# EAGLE design electrical stuff 2.0 (EAGLE 9.1.1)
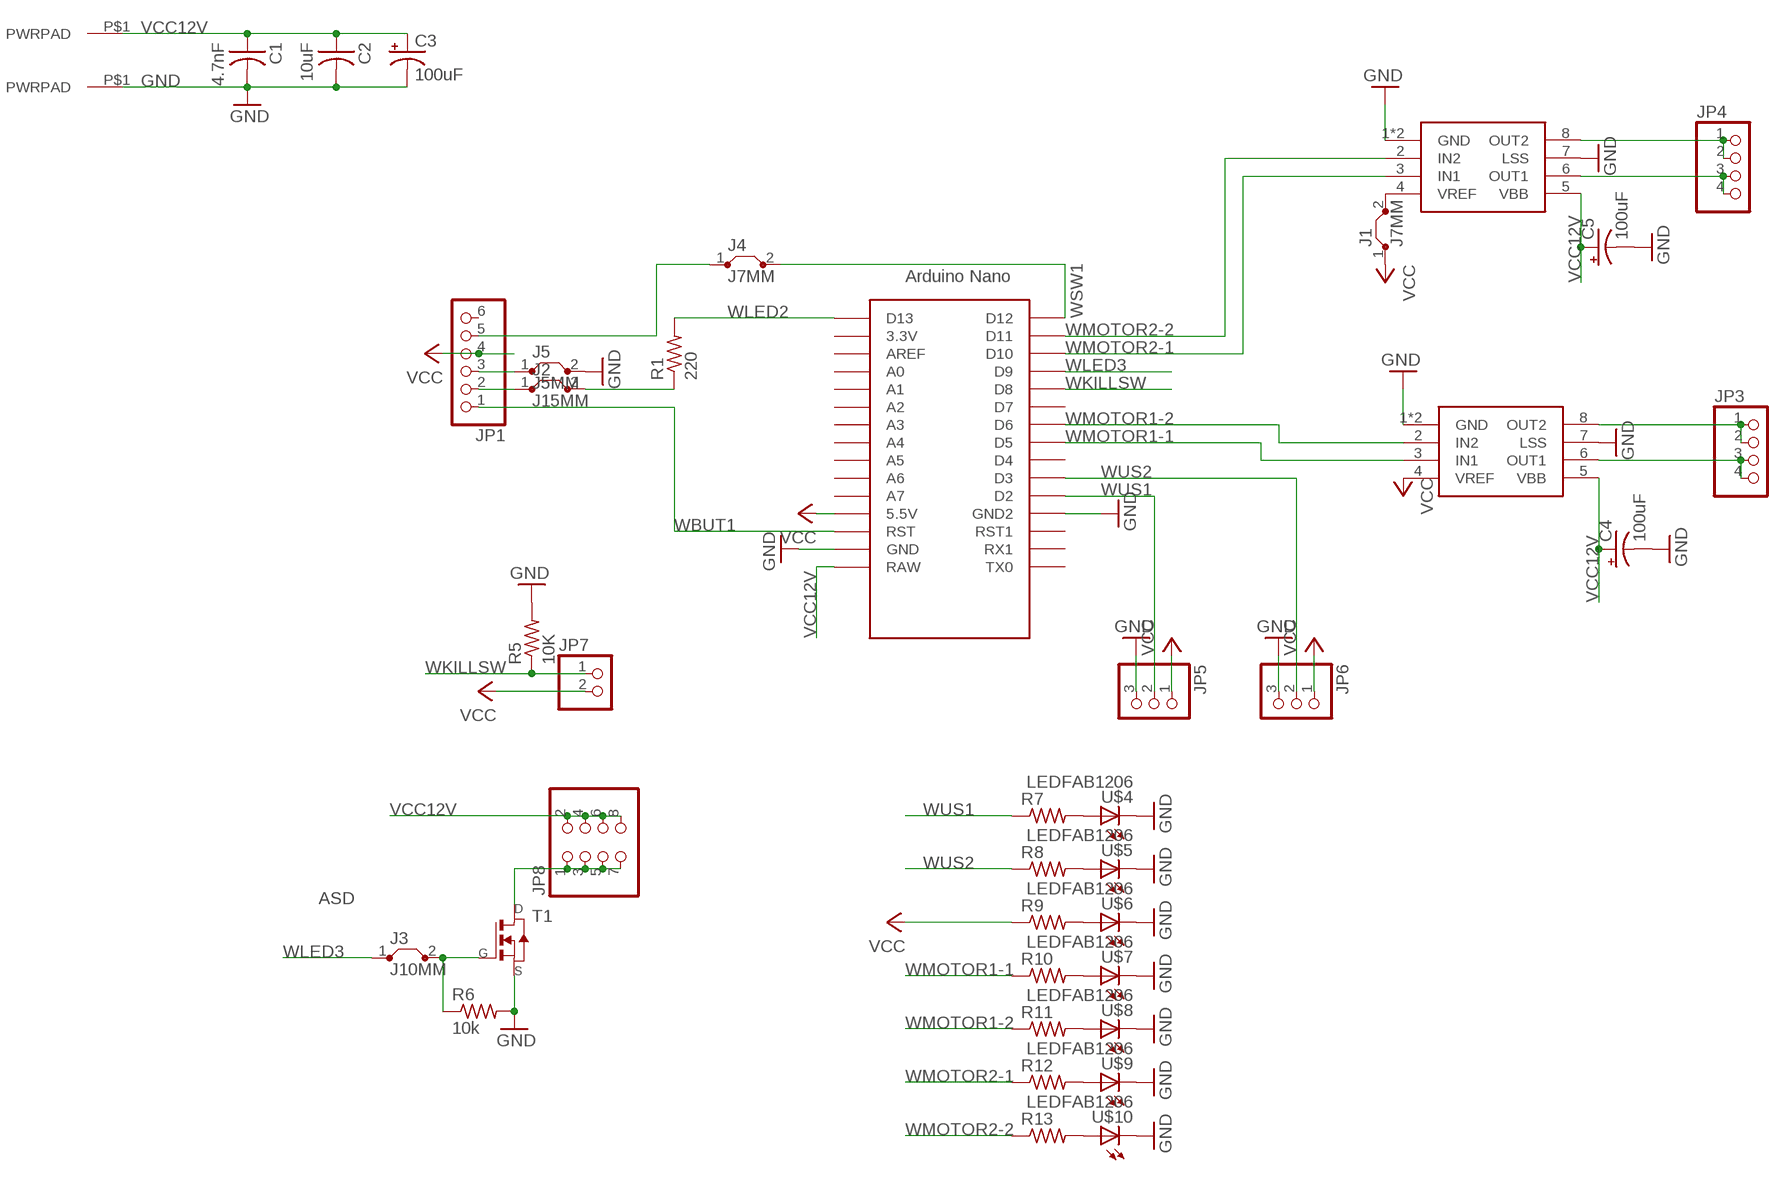
[diagram p0: schematic, sheet 1]

## Parts
C1  4.7nF  CAP-US1206FAB  [C1206FAB]
C2  10uF  CAP-US1206FAB  [C1206FAB]
C3  100uF  100UF-POLAR-RADIAL-2.5MM-25V-20%  [CPOL-RADIAL-2.5MM-6.5MM]
C4  100uF  100UF-POLAR-RADIAL-2.5MM-25V-20%  [CPOL-RADIAL-2.5MM-6.5MM]
C5  100uF  100UF-POLAR-RADIAL-2.5MM-25V-20%  [CPOL-RADIAL-2.5MM-6.5MM]
GND  PWRPAD2-5MM  [PWRPAD_2-5MM]
J1  J7MM  [07]
J2  J15MM  [15]
J3  J10MM  [10]
J4  J7MM  [07]
J5  J5MM  [05]
JP1  PINHD-1X6  [1X06]
JP3  PINHD-1X4  [1X04]
JP4  PINHD-1X4  [1X04]
JP5  PINHD-1X3  [1X03]
JP6  PINHD-1X3  [1X03]
JP7  PINHD-1X2  [1X02]
JP8  PINHD-2X4  [2X04]
R1  220  RES-US1206FAB  [R1206FAB]
R5  10K  RES-US1206FAB  [R1206FAB]
R6  10k  RES-US1206FAB  [R1206FAB]
R7  RES-US1206FAB  [R1206FAB]
R8  RES-US1206FAB  [R1206FAB]
R9  RES-US1206FAB  [R1206FAB]
R10  RES-US1206FAB  [R1206FAB]
R11  RES-US1206FAB  [R1206FAB]
R12  RES-US1206FAB  [R1206FAB]
R13  RES-US1206FAB  [R1206FAB]
T1  NMOSFETTO252  [TO252]
U$1  NANO  [NANO]
U$2  A4953  A4953-H-BRIDGE-MOTOR-DRIVER-PAD  [SOIC8_PAD]
U$3  A4953  A4953-H-BRIDGE-MOTOR-DRIVER-PAD  [SOIC8_PAD]
U$4  LEDFAB1206  [LED1206FAB]
U$5  LEDFAB1206  [LED1206FAB]
U$6  LEDFAB1206  [LED1206FAB]
U$7  LEDFAB1206  [LED1206FAB]
U$8  LEDFAB1206  [LED1206FAB]
U$9  LEDFAB1206  [LED1206FAB]
U$10  LEDFAB1206  [LED1206FAB]
VCC12V  VCC12V  PWRPAD2-5MM  [PWRPAD_2-5MM]

## Nets
ASD: J3.2 R6.1 T1.1(G)
GND: C1.2 C2.2 C3.2(-) C4.2(-) C5.2(-) GND.P$1(PWRPAD) J5.2 JP5.3 JP6.3 R5.2 R6.2 T1.2(S) U$1.GND U$1.GND1(GND2) U$2.1(GND) U$2.7(LSS) U$2.GND U$3.1(GND) U$3.7(LSS) U$3.GND U$4.2(C) U$5.2(C) U$6.2(C) U$7.2(C) U$8.2(C) U$9.2(C) U$10.2(C)
N$1: J5.1 JP1.3
N$2: JP8.1 JP8.3 JP8.5 JP8.7 T1.3(D)
N$3: JP4.3 JP4.4 U$3.6(OUT1)
N$5: J2.2 R1.1
N$8: JP4.1 JP4.2 U$3.8(OUT2)
N$9: JP3.1 JP3.2 U$2.8(OUT2)
N$10: JP3.3 JP3.4 U$2.6(OUT1)
N$11: J1.2 U$3.4(VREF)
N$14: J2.1 JP1.2
N$15: R7.2 U$4.1(A)
N$16: J4.1 JP1.5
N$17: R8.2 U$5.1(A)
N$18: R9.2 U$6.1(A)
N$19: R10.2 U$7.1(A)
N$20: R11.2 U$8.1(A)
N$21: R12.2 U$9.1(A)
N$22: R13.2 U$10.1(A)
VCC: J1.1 JP1.4 JP5.1 JP6.1 JP7.2 R9.1 U$1.5V(5.5V) U$2.4(VREF)
VCC12V: C1.1 C2.1 C3.1(+) C4.1(+) C5.1(+) JP8.2 JP8.4 JP8.6 JP8.8 U$1.RAW U$2.5(VBB) U$3.5(VBB) VCC12V.P$1(PWRPAD)
WBUT1: JP1.1 U$1.RST
WKILLSW: JP7.1 R5.1 U$1.D8
WLED2: R1.2 U$1.D13
WLED3: J3.1 U$1.D9
WMOTOR1-1: R10.1 U$1.D5 U$2.3(IN1)
WMOTOR1-2: R11.1 U$1.D6 U$2.2(IN2)
WMOTOR2-1: R12.1 U$1.D10 U$3.3(IN1)
WMOTOR2-2: R13.1 U$1.D11 U$3.2(IN2)
WSW1: J4.2 U$1.D12
WUS1: JP5.2 R7.1 U$1.D2
WUS2: JP6.2 R8.1 U$1.D3
Unconnected: JP1.6 U$1.3.3V U$1.A0 U$1.A1 U$1.A2 U$1.A3 U$1.A4 U$1.A5 U$1.A6 U$1.A7 U$1.AREF U$1.D4 U$1.D7 U$1.ICSP1 U$1.ICSP2 U$1.ICSP3 U$1.ICSP4 U$1.ICSP5 U$1.ICSP6 U$1.RST1 U$1.RX1 U$1.TX0

## Library data of the parts
C1 C2 = fab:CAP-US
C3-C5 = SparkFun-Capacitors:100UF-POLAR: 100µF polarized capacitors A capacitor is a passive two-terminal electrical component used to store electrical energy temporarily in an electric field.; PROD_ID: CAP-08439
GND VCC12V = fab:PWRPAD
J1-J5 = jumper:J: Bridge
JP1 = pinhead:PINHD-1X6: PIN HEADER
JP3 JP4 = pinhead:PINHD-1X4: PIN HEADER
JP5 JP6 = pinhead:PINHD-1X3: PIN HEADER
JP7 = pinhead:PINHD-1X2: PIN HEADER
JP8 = pinhead:PINHD-2X4: PIN HEADER
R1 R5-R13 = fab:RES-US: Resistor (US Symbol) Variants with postfix FAB are widened to allow the routing of internal traces
T1 = fab:NMOSFET: MOS FET
U$1 = Arduino-clone:NANO: Arduino Nano
U$2 U$3 = fab:A4953-H-BRIDGE-MOTOR-DRIVER-PAD
U$4-U$10 = fab:LED: LED

## Board
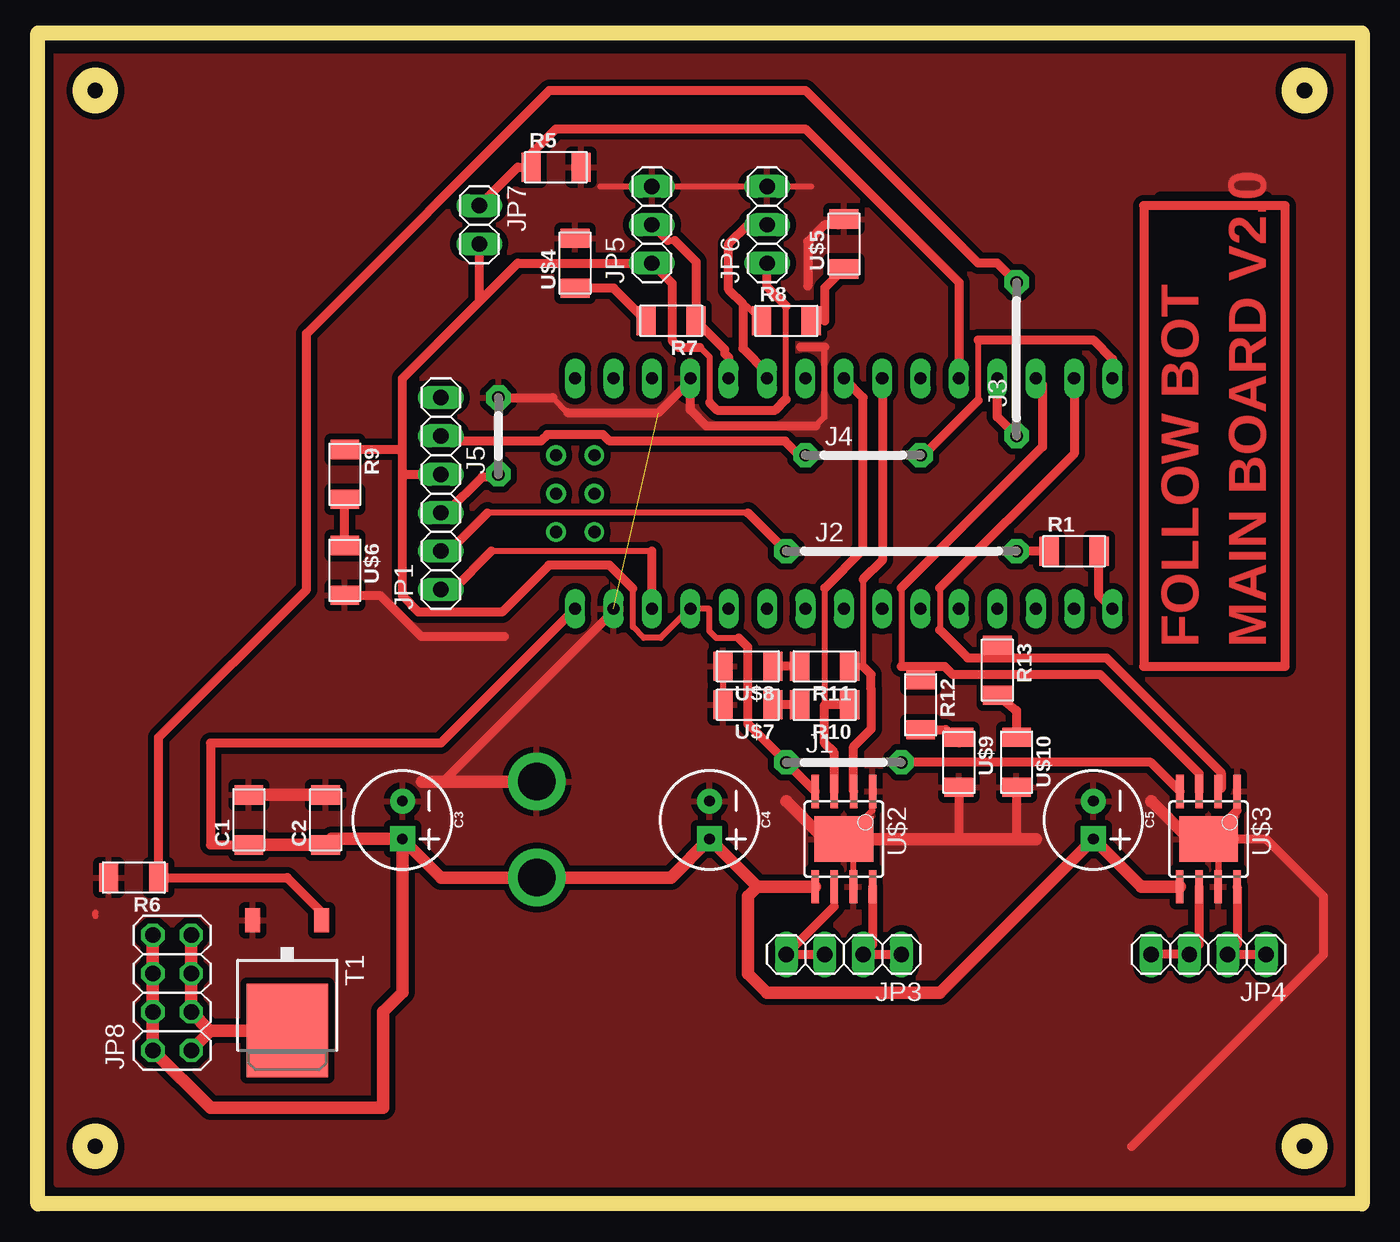
[diagram p1: board, top side]

Size 87.61 x 77.14 mm. Coordinates in mm from the lower left corner, seen from the top.
Outline: 0,0 87.61,0 87.61,77.14 0,77.14 0,0
Copper layers (1*16): Top 0.035mm / dielectric 1.5mm / Bottom 0.035mm
Design rules "default *": minimum track width 16mil, minimum drill 0.35mm, track to track 16mil, track to pad 16mil, pad to pad 16mil, via to via 16mil, smd to smd 6mil, copper to edge 40mil, drill to drill 6mil, minimum pad ring 10mil, minimum via ring 8mil, stop-mask expansion 4mil, vias tented up to drill 0mil, thermal gap 16mil
Milling: area 2.8,72.7 to 4.8,74.7; area 82.8,72.7 to 84.8,74.7; area 82.8,2.8 to 84.8,4.8; area 2.8,2.8 to 4.8,4.8; 4 lines

### Footprints (pad centres in the part's own frame; a part is rotated, then mirrored left to right if it is on the bottom)
C1206FAB = smd 1.27 x 1.905: 1 -1.651,0; 2 1.651,0
CPOL-RADIAL-2.5MM-6.5MM = drill 0.7 pad 1.651 square: 1 1.25,0 | drill 0.7 pad 1.651: 2 -1.25,0
PWRPAD_2-5MM = drill 2.489 pad 3.81: P$1 0,0
07 = drill 0.813 pad 1.6 octagon: 1 -3.81,0; 2 3.81,0
15 = drill 0.813 pad 1.6 octagon: 1 -7.62,0; 2 7.62,0
10 = drill 0.813 pad 1.6 octagon: 1 -5.08,0; 2 5.08,0
05 = drill 0.813 pad 1.6 octagon: 1 -2.54,0; 2 2.54,0
1X06 = drill 1.016 long: 1 -6.35,0; 2 -3.81,0; 3 -1.27,0; 4 1.27,0; 5 3.81,0; 6 6.35,0
1X04 = drill 1.016 long: 1 -3.81,0; 2 -1.27,0; 3 1.27,0; 4 3.81,0
1X03 = drill 1.016 long: 1 -2.54,0; 2 0,0; 3 2.54,0
1X02 = drill 1.016 long: 1 -1.27,0; 2 1.27,0
2X04 = drill 1.016 octagon: 1 -3.81,-1.27; 2 -3.81,1.27; 3 -1.27,-1.27; 4 -1.27,1.27; 5 1.27,-1.27; 6 1.27,1.27; 7 3.81,-1.27; 8 3.81,1.27
R1206FAB = smd 1.27 x 1.905: 1 -1.651,0; 2 1.651,0
TO252 = smd 1 x 1.6: 1 -2.28,-4.8; 2 2.28,-4.8 | smd 5.4 x 6.2: 3 0,2.5
NANO = drill 0.8 long: 3.3V -10.16,24.13; 5V -10.16,-1.27; A0 -10.16,19.05; A1 -10.16,16.51; A2 -10.16,13.97; A3 -10.16,11.43; A4 -10.16,8.89; A5 -10.16,6.35; A6 -10.16,3.81; A7 -10.16,1.27; AREF -10.16,21.59; D2 5.08,1.27; D3 5.08,3.81; D4 5.08,6.35; D5 5.08,8.89; D6 5.08,11.43; D7 5.08,13.97; D8 5.08,16.51; D9 5.08,19.05; D10 5.08,21.59; D11 5.08,24.13; D12 5.08,26.67; D13 -10.16,26.67; GND -10.16,-6.35; GND1 5.08,-1.27; RAW -10.16,-8.89; RST -10.16,-3.81; RST1 5.08,-3.81; RX1 5.08,-6.35; TX0 5.08,-8.89 | drill 0.8: ICSP1 -5.08,-10.16; ICSP2 -5.08,-7.62; ICSP3 -2.54,-10.16; ICSP4 -2.54,-7.62; ICSP5 0,-10.16; ICSP6 0,-7.62
SOIC8_PAD = smd 0.5 x 2.2: 1 -1.905,-3.154; 2 -0.645,-3.154; 3 0.625,-3.154; 4 1.895,-3.154; 5 1.905,3.154; 6 0.635,3.154; 7 -0.635,3.154; 8 -1.905,3.154 | smd 3.886 x 2.997: GND 0,0
LED1206FAB = smd 1.27 x 1.905: 1 -1.651,0; 2 1.651,0

### Placement (x,y rotation side)
C1  13.97,25.4 90 top
C2  19.05,25.4 90 top
C3  24.13,25.4 270 top
C4  44.45,25.4 270 top
C5  69.85,25.4 270 top
GND  33.02,27.94 0 top
J1  53.34,29.21 0 top
J2  57.15,43.18 0 top
J3  64.77,55.88 90 top
J4  54.61,49.53 0 top
J5  30.48,50.8 90 top
JP1  26.67,46.99 90 top
JP3  53.34,16.51 180 top
JP4  77.47,16.51 180 top
JP5  40.64,64.77 90 top
JP6  48.26,64.77 90 top
JP7  29.21,64.77 270 top
JP8  8.89,13.97 90 top
R1  68.58,43.18 0 top
R5  34.29,68.58 0 top
R6  6.35,21.59 180 top
R7  41.91,58.42 180 top
R8  49.54,58.41 0 top
R9  20.32,48.26 270 top
R10  52.07,33.02 180 top
R11  52.07,35.56 180 top
R12  58.42,33.02 270 top
R13  63.5,35.31 270 top
T1  16.51,13.97 180 top
U$1  44.45,49.53 90 bottom
U$2  53.34,24.13 180 top
U$3  77.47,24.13 180 top
U$4  35.56,62.23 90 top
U$5  53.34,63.5 90 top
U$6  20.32,41.91 270 top
U$7  46.99,33.02 180 top
U$8  46.99,35.56 180 top
U$9  60.96,29.21 270 top
U$10  64.77,29.21 270 top
VCC12V  33.02,21.59 0 top

### Tracks (layer width: path | path; a pad name or v marks a point on that pad's centre or on a via)
ASD
  Top 0.406: 18.79,19.31 T1.1
  Top 0.61: J3.2 63.5,62.23 62.23,62.23 50.8,73.66 33.86,73.66 17.78,57.58 17.78,40.64 8,30.86 R6.1 16.51,21.59 18.79,19.31
GND  (1 unrouted)
  Top 0.406: U$2.7 53.97,23.49 U$2.GND 55.25,26.04 U$2.1 | U$3.GND 78.11,23.49 U$3.7 | 79.38,26.04 U$3.1 | U$8.2 U$7.2 | JP5.3 JP6.3 51.18,67.31 | 38.99,67.31 JP5.3 | 37.21,67.31 JP5.3 | 4.7,20.68 R6.2 4.7,21.21 | 34.08,53.34 35.07,52.35 | U$5.2 52.96,64.77 | 51.47,51.48 52.07,52.07 52.07,56.67 | 3.81,19.05 3.81,19.27
  Top 0.61: 79.38,26.04 U$3.GND 81.28,24.13 85.09,20.32 85.09,16.51 72.39,3.81 | 26.83,27.94 38.1,39.21 U$1.GND | U$9.2 60.96,24.13 | U$10.2 64.77,24.13 | U$6.2 22.65,40.26 25.37,37.54 30.86,37.54 | J5.2 34.08,53.34 | 35.07,52.35 41.08,52.35 43.18,54.46 U$1.GND1 43.18,52.53 44.23,51.48 51.47,51.48 | 52.96,64.77 52.07,64.77 50.95,63.65 50.95,60.72 | 52.07,56.67 50.48,56.67
  Top 0.813: GND.P$1 26.83,27.94 26.67,27.94 25.42,27.94 | C2.2 C1.2 | 49.55,26.65 52.07,24.13 U$2.GND 60.96,24.13 64.77,24.13 66.06,24.13 | 73.68,26.65 76.2,24.13 U$3.GND
  pour Top: 1.27,76.2 86.36,76.2 86.36,1.27 1.27,1.27
N$1
  Top 0.61: J5.1 30.34,48.12 29.43,48.12 27.03,45.72 JP1.3
N$2
  Top 0.813: T1.3 11.39,11.47 | 11.39,11.47 JP8.3 JP8.5 JP8.7 | 11.39,11.47 11.39,11.39 JP8.1
N$3
  Top 0.406: 76.83,17.14 JP4.3
  Top 0.61: U$3.6 76.83,17.14 | JP4.3 JP4.4
N$4
  Top 0.61: 73.18,35.56 82.55,35.56 82.55,66.04 73.18,66.04 73.18,35.56
N$5
  Top 0.61: R1.1 J2.2
N$8
  Top 0.406: 79.38,17.14 JP4.2
  Top 0.61: U$3.8 79.38,17.14 | JP4.2 JP4.1
N$9
  Top 0.406: 55.25,17.14 JP3.2
  Top 0.61: U$2.8 55.25,17.14 | JP3.2 JP3.1
N$10
  Top 0.406: 52.7,19.68 U$2.6
  Top 0.61: 52.7,19.68 JP3.4 JP3.3
N$11
  Top 0.61: U$3.4 73.65,29.21 J1.2
N$14
  Top 0.406: 46.99,45.72 29.76,45.72
  Top 0.61: J2.1 46.99,45.72 | 29.76,45.72 27.21,43.18 JP1.2
N$15
  Top 0.61: R7.2 38.1,60.58 U$4.1
N$16
  Top 0.61: JP1.5 27.02,50.45 33.28,50.45 33.72,50.89 37.39,50.89 37.84,50.45 49.45,50.45 50.38,49.53 J4.1
N$17
  Top 0.406: 52.07,58.41 R8.2
  Top 0.61: U$5.1 52.07,60.58 52.07,58.41
N$18
  Top 0.406: R9.2 20.32,46.99 R9.2
  Top 0.61: U$6.1 R9.2
N$19
  Top 0.61: R10.2 U$7.1
N$20
  Top 0.61: R11.2 U$8.1
N$21
  Top 0.406: 60.96,30.48 U$9.1
  Top 0.61: R12.2 60.07,31.37 60.96,30.48
N$22
  Top 0.61: R13.2 64.77,32.64 U$10.1
VCC
  Top 0.406: J1.1 | 46.39,37.43 44.91,37.43 44.44,37.89 44.44,39.37 U$1.5V 43.13,39.37 41.21,37.45 40.09,37.45 39.38,38.16 39.38,40.7 | 23.75,49.91 24.13,49.53 | 26.65,48.28 JP1.4 | 43.82,56.66 44.45,56.03 44.45,53.76 44.46,53.75 44.46,53 | 49.52,53.22 49.52,59.4
  Top 0.61: U$2.4 J1.1 | J1.1 46.99,31.75 46.99,36.83 46.39,37.43 | 39.38,40.7 37.83,42.25 33.82,42.25 30.72,39.15 25.2,39.15 24.13,40.22 24.13,48.28 | 24.13,48.28 26.65,48.28 | 24.13,48.28 24.13,49.53 24.13,54.61 29.21,59.69 | 29.21,59.69 31.75,62.23 JP5.1 41.97,60.9 41.97,57.1 42.4,56.66 43.82,56.66 | JP7.2 29.21,59.69 | R9.1 23.75,49.91 | 44.46,53 44.95,52.51 48.82,52.51 49.52,53.22 | JP6.1 48.26,60.66 49.52,59.4
VCC12V
  Top 0.61: U$1.RAW 26.67,30.48 11.43,30.48 11.43,23.75 C1.1
  Top 0.813: 24.15,24.13 26.69,21.59 VCC12V.P$1 41.89,21.59 C4.1 47.62,20.98 | C1.1 C2.1 19.45,24.15 C3.1 24.15,24.13 | 47.62,20.98 U$2.5 | 47.62,20.98 46.99,20.34 46.99,15.24 48.26,13.97 59.69,13.97 69.85,24.13 C5.1 73.02,20.98 U$3.5 | 24.15,24.13 24.15,13.99 22.86,12.7 22.86,6.35 11.43,6.35 JP8.2 JP8.4 JP8.6 JP8.8
WBUT1
  Top 0.406: 40.64,43.18 30,43.18
  Top 0.61: U$1.RST 40.64,43.18 | 30,43.18 27.47,40.64 JP1.1
WKILLSW
  Top 0.406: R5.1 32.64,69.47
  Top 0.61: JP7.1 31.75,68.58 R5.1 | 32.64,69.47 34.29,71.12 50.8,71.12 60.96,60.96 U$1.D8
WLED2
  Top 0.61: U$1.D13 70.23,40.26 R1.2
WLED3
  Top 0.61: J3.1 63.5,52.07 U$1.D9
WMOTOR1-1
  Top 0.406: 52.07,33.02 52.08,33.03 52.08,40.73
  Top 0.61: U$2.3 52.72,29.84 52.07,30.48 52.07,33.02 R10.1 | 52.08,40.73 54.61,43.27 54.61,53.34 U$1.D5
WMOTOR1-2
  Top 0.406: R11.1 54.61,35.56 54.61,41.31 | 55.16,34.03 55.14,34.05
  Top 0.61: U$1.D6 55.88,42.57 54.61,41.31 | 55.16,34.03 55.16,31.43 53.98,30.26 U$2.2 | 55.14,34.05 55.14,35.03 54.61,35.56
WMOTOR2-1
  Top 0.406: 57.15,40.75 57.15,35.56 | 58.42,35.56 R12.1
  Top 0.61: 57.15,40.75 66.48,50.08 66.48,54.17 U$1.D10 | 57.15,35.56 58.42,35.56 60,35.56 60.53,35.04 70.28,35.04 76.84,28.47 U$3.3
WMOTOR2-2
  Top 0.406: 59.69,40.75 59.69,37.97 | 69.85,36.12 69.86,36.12 | 63.5,36.12 R13.1 | 78.31,27.48 U$3.2
  Top 0.61: U$1.D11 68.58,49.64 59.69,40.75 | 59.69,37.97 61.54,36.12 63.5,36.12 69.85,36.12 | 78.31,27.48 78.31,28.53 70.72,36.12 69.86,36.12
WSW1
  Top 0.406: 62.23,53.15 62.23,57.15 | 71.12,55.88 U$1.D12
  Top 0.61: 62.23,53.15 58.61,49.53 J4.2 | 71.12,55.88 69.85,57.15 62.23,57.15
WUS1
  Top 0.406: 41.69,63.72 42.16,63.72 | 45.47,56.52 45.47,56.26
  Top 0.61: JP5.2 41.69,63.72 | 42.16,63.72 43.56,62.32 R7.1 45.47,56.52 | 45.47,56.26 45.72,56 U$1.D2
WUS2
  Top 0.406: R8.1 45.82,60.48 45.72,60.48 | 46.99,64.77 JP6.2
  Top 0.61: 46.99,64.77 45.72,63.5 45.72,60.48 46.66,59.54 46.66,56.59 48.26,54.99 U$1.D3
(copper drawn outside any net)
  shapes: Top circle x4

### Text on the board
Top: FOLLOW BOT / MAIN BOARD V2.0